# Altium project SmartMouse2016.PrjPcb
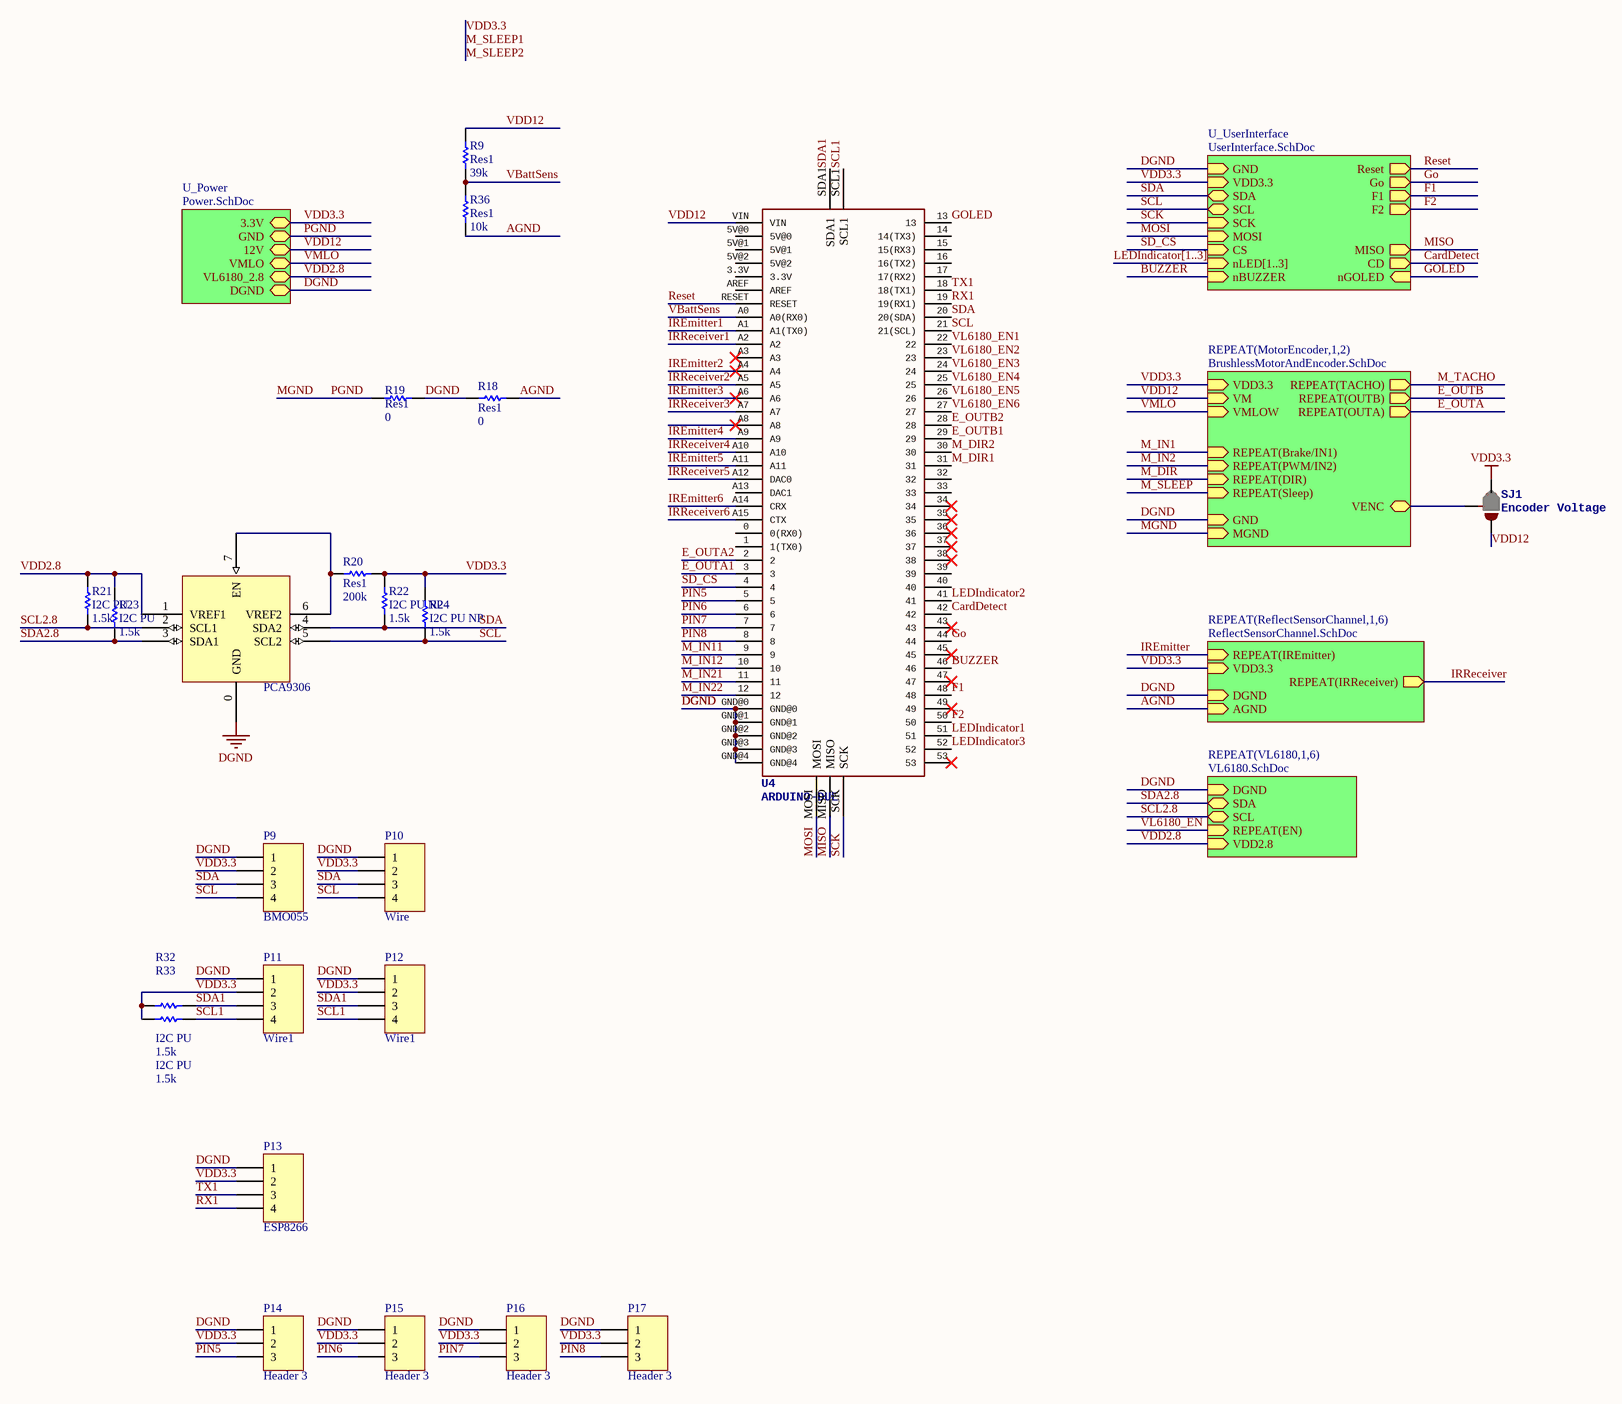
[diagram p0: Sheet1.SchDoc]
7 sheets, 151 parts. Net scope: strictly hierarchical (ports join the sheet entries above them; power ports are local).
Board file: SmartMouse2016.PcbDoc
Sheets:
  Sheet1.SchDoc
    ReflectSensorChannel1 = ReflectSensorChannel.SchDoc
    ReflectSensorChannel2 = ReflectSensorChannel.SchDoc
    ReflectSensorChannel3 = ReflectSensorChannel.SchDoc
    ReflectSensorChannel4 = ReflectSensorChannel.SchDoc
    ReflectSensorChannel5 = ReflectSensorChannel.SchDoc
    ReflectSensorChannel6 = ReflectSensorChannel.SchDoc
    U_UserInterface = UserInterface.SchDoc
      LEDIndicator1 = LEDChannel.SchDoc
      LEDIndicator2 = LEDChannel.SchDoc
      LEDIndicator3 = LEDChannel.SchDoc
    U_Power = Power.SchDoc
    MotorEncoder1 = BrushlessMotorAndEncoder.SchDoc
    MotorEncoder2 = BrushlessMotorAndEncoder.SchDoc
    VL61801 = VL6180.SchDoc
    VL61802 = VL6180.SchDoc
    VL61803 = VL6180.SchDoc
    VL61804 = VL6180.SchDoc
    VL61805 = VL6180.SchDoc
    VL61806 = VL6180.SchDoc

## Sheet Sheet1.SchDoc
size A2; PageSetup: Record=PageOptions|CenterHorizontal=True|CenterVertical=True|PrintScale=4.35|XCorrection=1.00|YCorrection=1.00|PrintKind=1|BorderSize=5000000|LeftOffset=0|BottomOffset=0|Orientation=2|PaperLength=1000|PaperWidth=1000|Scale=100|PaperSource=7|PrintQuality=-3|MediaType=1|DitherType=10|PrintScaleMode=1|PaperKind=A0|PaperIndex=139

### Parts
P9  BMO055  [PH_4_PTH]
P10  Wire  [PH_4_PTH]
P11  Wire1  [PH_4_PTH]
P12  Wire1  [PH_4_PTH]
P13  ESP8266  [PH_4_PTH]
P14  Header 3  [HDR1X3]
P15  Header 3  [HDR1X3]
P16  Header 3  [HDR1X3]
P17  Header 3  [HDR1X3]
PCA1  PCA9306  [SOIC_E200_8]
R9  Res1  value 39k  [RES_0805]
R18  Res1  value 0  [RES_0805]
R19  Res1  value 0  [RES_0805]
R20  Res1  value 200k  [RES_0805]
R21  I2C PU  value 1.5k  [RES_0805]
R22  I2C PU NP  value 1.5k  [RES_0805]
R23  I2C PU  value 1.5k  [RES_0805]
R24  I2C PU NP  value 1.5k  [RES_0805]
R32  I2C PU  value 1.5k  [RES_0805]
R33  I2C PU  value 1.5k  [RES_0805]
R36  Res1  value 10k  [RES_0805]
SJ1  Encoder Voltage  [PAD-JUMPER-3-2OF3_NC_BY_PASTE_YES_SILK_FULL_BOX]
U4  ARDUINO-DUE  [ARDUINO_DUE]

### Sub-sheets
REPEAT(MotorEncoder,1,2) = BrushlessMotorAndEncoder.SchDoc: VM, MGND, REPEAT(Brake/IN1) (in), REPEAT(PWM/IN2) (in), REPEAT(DIR) (in), REPEAT(TACHO) (out), GND, REPEAT(OUTB) (out), REPEAT(OUTA) (out), VDD3.3, REPEAT(Sleep) (in), VMLOW, VENC
REPEAT(ReflectSensorChannel,1,6) = ReflectSensorChannel.SchDoc: REPEAT(IREmitter) (in), REPEAT(IRReceiver) (out), VDD3.3, DGND, AGND
REPEAT(VL6180,1,6) = VL6180.SchDoc: DGND, SDA (bidir), SCL (bidir), REPEAT(EN) (in), VDD2.8
U_Power = Power.SchDoc: 3.3V, GND, 12V, VMLO, VL6180_2.8, DGND
U_UserInterface = UserInterface.SchDoc: GND, VDD3.3, SDA (bidir), SCL (bidir), Reset (out), Go (out), F1 (out), F2 (out), SCK (in), MISO (out), MOSI (in), CS (in), CD (out), nLED[1..3] (in), nBUZZER (in), nGOLED (in)

### Nets
AGND: R18.2 R36.1 ; sheet REPEAT(ReflectSensorChannel,1,6)/AGND
DGND: P9.1 P10.1 P11.1 P12.1 P13.1 P14.1 P15.1 P16.1 P17.1 PCA1.0(GND) R18.1 R19.2 U4.GND@0 U4.GND@1 U4.GND@2 U4.GND@3 U4.GND@4 ; sheet REPEAT(ReflectSensorChannel,1,6)/DGND, sheet U_UserInterface/GND, sheet U_Power/DGND, sheet REPEAT(MotorEncoder,1,2)/GND, sheet REPEAT(VL6180,1,6)/DGND
M_SLEEP1: P9.2 P10.2 P11.2 P12.2 P13.2 P14.2 P15.2 P16.2 P17.2 R20.2 R22.2 R24.2 R32.1 R33.1 SJ1.3 ; sheet REPEAT(ReflectSensorChannel,1,6)/VDD3.3, sheet U_UserInterface/VDD3.3, sheet U_Power/3.3V, sheet REPEAT(MotorEncoder,1,2)/VDD3.3  [also labelled M_SLEEP2, VDD3.3]  [project net LEDA]
MGND: R19.1 ; sheet U_Power/GND, sheet REPEAT(MotorEncoder,1,2)/MGND  [also labelled PGND]
VDD2.8: PCA1.1(VREF1) R21.2 R23.2 ; sheet U_Power/VL6180_2.8, sheet REPEAT(VL6180,1,6)/VDD2.8
VMLO: sheet U_Power/VMLO, sheet REPEAT(MotorEncoder,1,2)/VMLOW  [project net VDD_VMLO]
BUZZER: U4.46 ; sheet U_UserInterface/nBUZZER
CardDetect: U4.42 ; sheet U_UserInterface/CD
E_OUTA: sheet REPEAT(MotorEncoder,1,2)/REPEAT(OUTA)
E_OUTA1: U4.3
E_OUTA2: U4.2
E_OUTB: sheet REPEAT(MotorEncoder,1,2)/REPEAT(OUTB)
E_OUTB1: U4.29
E_OUTB2: U4.28
F1: U4.48 ; sheet U_UserInterface/F1
F2: U4.50 ; sheet U_UserInterface/F2
Go: U4.44 ; sheet U_UserInterface/Go
GOLED: U4.13 ; sheet U_UserInterface/nGOLED
IREmitter: sheet REPEAT(ReflectSensorChannel,1,6)/REPEAT(IREmitter)
IREmitter1: U4.A1(A1(TX0))
IREmitter2: U4.A4
IREmitter3: U4.A6
IREmitter4: U4.A9
IREmitter5: U4.A11
IREmitter6: U4.A14(CRX)
IRReceiver: sheet REPEAT(ReflectSensorChannel,1,6)/REPEAT(IRReceiver)
IRReceiver1: U4.A2
IRReceiver2: U4.A5
IRReceiver3: U4.A7
IRReceiver4: U4.A10
IRReceiver5: U4.A12(DAC0)
IRReceiver6: U4.A15(CTX)
LEDIndicator1: U4.51
LEDIndicator2: U4.41
LEDIndicator3: U4.52
M_DIR: sheet REPEAT(MotorEncoder,1,2)/REPEAT(DIR)
M_DIR1: U4.31
M_DIR2: U4.30
M_IN1: sheet REPEAT(MotorEncoder,1,2)/REPEAT(Brake/IN1)
M_IN2: sheet REPEAT(MotorEncoder,1,2)/REPEAT(PWM/IN2)
M_IN11: U4.9
M_IN12: U4.10
M_IN21: U4.11
M_IN22: U4.12
M_SLEEP: sheet REPEAT(MotorEncoder,1,2)/REPEAT(Sleep)
M_TACHO: sheet REPEAT(MotorEncoder,1,2)/REPEAT(TACHO)
MISO: U4.MISO ; sheet U_UserInterface/MISO
MOSI: U4.MOSI ; sheet U_UserInterface/MOSI
PIN5: P14.3 U4.5
PIN6: P15.3 U4.6
PIN7: P16.3 U4.7
PIN8: P17.3 U4.8
Reset: U4.RESET ; sheet U_UserInterface/Reset
RX1: P13.4 U4.19(19(RX1))
SCK: U4.SCK ; sheet U_UserInterface/SCK
SCL: P9.4 P10.4 PCA1.5(SCL2) R24.1 U4.21(21(SCL)) ; sheet U_UserInterface/SCL
SCL1: P11.4 P12.4 R33.2 U4.SCL1
SCL2.8: PCA1.2(SCL1) R21.1 ; sheet REPEAT(VL6180,1,6)/SCL
SD_CS: U4.4 ; sheet U_UserInterface/CS
SDA: P9.3 P10.3 PCA1.4(SDA2) R22.1 U4.20(20(SDA)) ; sheet U_UserInterface/SDA
SDA1: P11.3 P12.3 R32.2 U4.SDA1
SDA2.8: PCA1.3(SDA1) R23.1 ; sheet REPEAT(VL6180,1,6)/SDA
TX1: P13.3 U4.18(18(TX1))
VBattSens: R9.1 R36.2 U4.A0(A0(RX0))
VDD12: R9.2 SJ1.1 U4.VIN ; sheet U_Power/12V, sheet REPEAT(MotorEncoder,1,2)/VM  [project net SWITCHED_12]
VL6180_EN: sheet REPEAT(VL6180,1,6)/REPEAT(EN)
VL6180_EN1: U4.22
VL6180_EN2: U4.23
VL6180_EN3: U4.24
VL6180_EN4: U4.25
VL6180_EN5: U4.26
VL6180_EN6: U4.27
NetP2_MotorEncoder1_1: SJ1.2 ; sheet REPEAT(MotorEncoder,1,2)/VENC
NetPCA1_6: PCA1.6(VREF2) PCA1.7(EN) R20.1

Not connected (* = marked no-connect by the designer): U4 0(0(RX0)) 1(1(TX0)) 3.3V 5V@0 5V@1 5V@2 14(14(TX3)) 15(15(RX3)) 16(16(TX2)) 17(17(RX2)) 32 33 34* 35* 36* 37* 38* 39 40 43* 45* 47* 49* 53* A3* A8* A13(DAC1) AREF

### Buses and harness runs
bus LEDIndicator[1..3] = sheet U_UserInterface/nLED[1..3]

### Library data of the parts
P9-P13 = Header 4: Header, 4-Pin; LatestRevisionDate: 17-Jul-2002; LatestRevisionNote: Re-released for DXP Platform.; Publisher: Altium Limited
P14-P17 = Header 3: Header, 3-Pin; LatestRevisionDate: 17-Jul-2002; LatestRevisionNote: Re-released for DXP Platform.; Publisher: Altium Limited
PCA1 = Component_1_1: I2C shifting voltage; pin to pad: 0>1 1>2 2>3 3>4 4>5 5>6 6>7 7>8
R9 R18-R24 R32 R33 R36 = Res1: Resistor; Published: 8-Jun-2000; LatestRevisionDate: 17-Jul-2002; LatestRevisionNote: Re-released for DXP Platform.; PackageReference: AXIAL-0.3; Publisher: Altium Limited; PackageDescription: Axial Device, Thru-Hole; 2 Leads; 0.3 in Pin Spacing
SJ1 = JUMPER-PAD-3-2OF3_NC_BY_PASTE

## Sheet ReflectSensorChannel.SchDoc
size A
Used 6 times, as channels ReflectSensorChannel1, ReflectSensorChannel2, ReflectSensorChannel3, ReflectSensorChannel4, ReflectSensorChannel5, ReflectSensorChannel6. Parts and nets are listed once, with the designators drawn on the sheet.
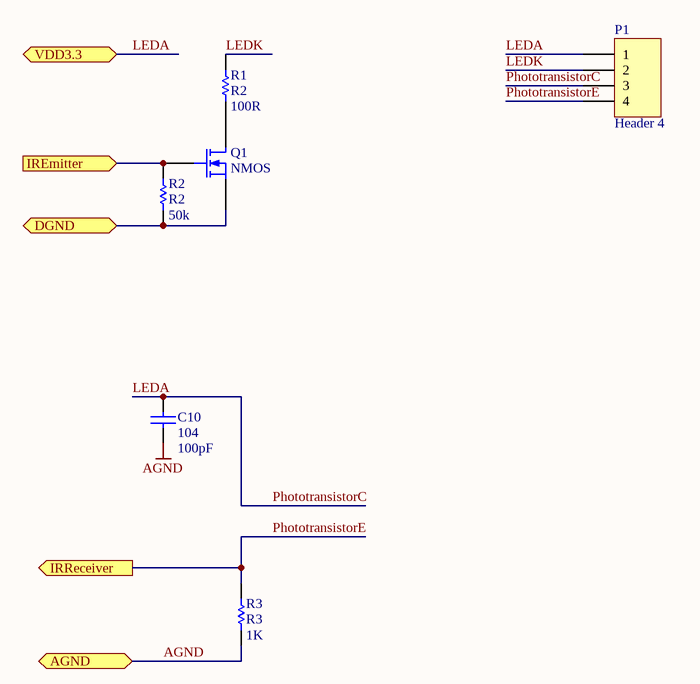
[diagram p1: ReflectSensorChannel.SchDoc]

### Parts
C10  104  value 100pF  [CAP_0805]
P1  Header 4  [PH_4_PTH]
Q1  NMOS  [SOT23-3]
R1  R2  value 100R  [RES_0805]
R2  R2  value 50k  [RES_0805]
R3  R3  value 1K  [RES_0805]

### Ports
AGND, DGND, IREmitter (in), IRReceiver (out), VDD3.3

### Nets
AGND: C10.1 R3.1 ; port AGND
DGND: Q1.3(S) R2.1 ; port DGND
IREmitter: Q1.2(G) R2.2 ; port IREmitter
LEDA: C10.2 P1.1 P1.3 ; port VDD3.3  [also labelled PhototransistorC]
LEDK: P1.2 R1.2
PhototransistorE: P1.4 R3.2 ; port IRReceiver
NetQ1_1: Q1.1(D) R1.1

### Channels
ReflectSensorChannel1: designators end in _ReflectSensorChannel1; ports AGND=AGND DGND=DGND IREmitter=IREmitter1 IRReceiver=IRReceiver1 VDD3.3=LEDA
ReflectSensorChannel2: designators end in _ReflectSensorChannel2; ports AGND=AGND DGND=DGND IREmitter=IREmitter2 IRReceiver=IRReceiver2 VDD3.3=LEDA
ReflectSensorChannel3: designators end in _ReflectSensorChannel3; ports AGND=AGND DGND=DGND IREmitter=IREmitter3 IRReceiver=IRReceiver3 VDD3.3=LEDA
ReflectSensorChannel4: designators end in _ReflectSensorChannel4; ports AGND=AGND DGND=DGND IREmitter=IREmitter4 IRReceiver=IRReceiver4 VDD3.3=LEDA
ReflectSensorChannel5: designators end in _ReflectSensorChannel5; ports AGND=AGND DGND=DGND IREmitter=IREmitter5 IRReceiver=IRReceiver5 VDD3.3=LEDA
ReflectSensorChannel6: designators end in _ReflectSensorChannel6; ports AGND=AGND DGND=DGND IREmitter=IREmitter6 IRReceiver=IRReceiver6 VDD3.3=LEDA

### Library data of the parts
C10 = Cap: Capacitor; Published: 8-Jun-2000; LatestRevisionDate: 17-Jul-2002; LatestRevisionNote: Re-released for DXP Platform.; PackageReference: RAD-0.3; Publisher: Altium Limited; PackageDescription: Radial Cap, Thru-Hole; 2 Leads; 0.3 in Pin Spacing
P1 = Header 4: Header, 4-Pin; LatestRevisionDate: 17-Jul-2002; LatestRevisionNote: Re-released for DXP Platform.; Publisher: Altium Limited
Q1 = MOSFET-N: N-Channel MOSFET; pin to pad: 1>3 2>1 3>2; Published: 8-Jun-2000; LatestRevisionDate: 17-Jul-2002; LatestRevisionNote: Re-released for DXP Platform.; PackageVersion: 1995/1996; PackageReference: E3; Publisher: Altium Limited; PackageDescription: TO, Flat Index; 3 In-Line, Axial Leads; Body Dia. 4.6mm; Lead Dia. 0.5 mm (max)
R1-R3 = Res1: Resistor; Published: 8-Jun-2000; LatestRevisionDate: 17-Jul-2002; LatestRevisionNote: Re-released for DXP Platform.; PackageReference: AXIAL-0.3; Publisher: Altium Limited; PackageDescription: Axial Device, Thru-Hole; 2 Leads; 0.3 in Pin Spacing

## Sheet UserInterface.SchDoc
size A
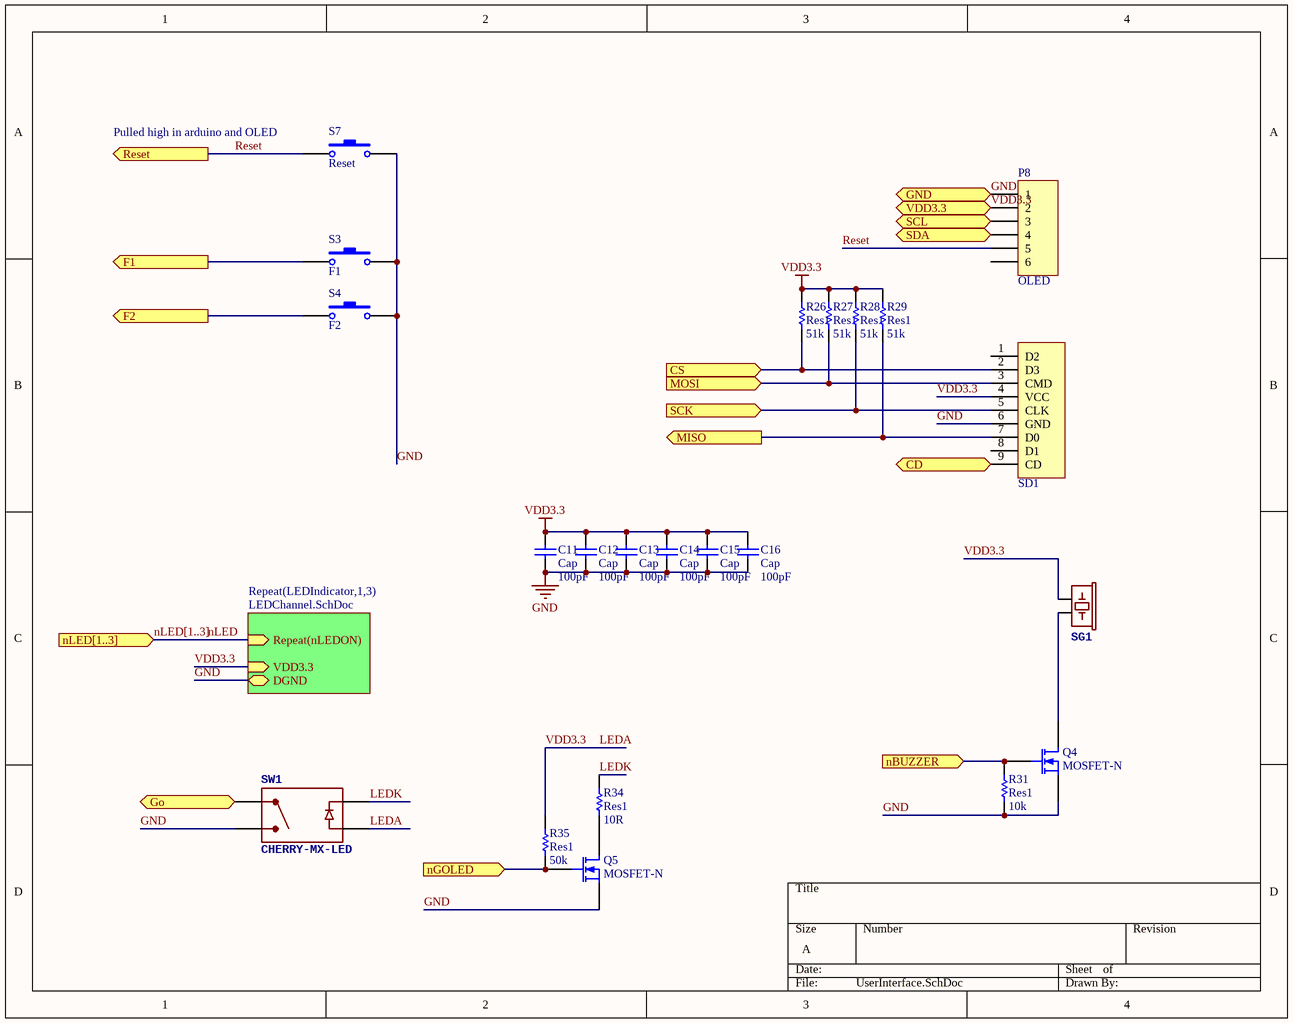
[diagram p2: UserInterface.SchDoc]

### Parts
C11  Cap  value 100pF  [CAP_0805]
C12  Cap  value 100pF  [CAP_0805]
C13  Cap  value 100pF  [CAP_0805]
C14  Cap  value 100pF  [CAP_0805]
C15  Cap  value 100pF  [CAP_0805]
C16  Cap  value 100pF  [CAP_0805]
P8  OLED  [OLEd]
Q4  MOSFET-N  [SOT23-3]
Q5  MOSFET-N  [SOT23-3]
R26  Res1  value 51k  [RES_0805]
R27  Res1  value 51k  [RES_0805]
R28  Res1  value 51k  [RES_0805]
R29  Res1  value 51k  [RES_0805]
R31  Res1  value 10k  [RES_0805]
R34  Res1  value 10R  [RES_0805]
R35  Res1  value 50k  [RES_0805]
S3  F1  [ButtonTACT_3x6x2.5_180]
S4  F2  [ButtonTACT_3x6x2.5_180]
S7  Reset  [ButtonTACT_3x6x2.5_180]
SD1  SD_Card_TF  [SD_Card_TF]  (value not drawn)
SG1  Buzzer 12mmSpark Fun Electronics SKU : Comp-Buzzer  [Buzzer_5x5]  (value not drawn)
SW1  CHERRY-MX-LED  [MX-LED]

### Sub-sheets
Repeat(LEDIndicator,1,3) = LEDChannel.SchDoc: DGND, VDD3.3 (in), Repeat(nLEDON) (in)

### Ports
CD (out), CS (in), F1 (out), F2 (out), GND, Go (out), MISO (out), MOSI (in), nBUZZER (in), nGOLED (in), nLED[1..3] (in), Reset (out), SCK (in), SCL (bidir), SDA (bidir), VDD3.3

### Nets
GND: C11.1 C12.1 C13.1 C14.1 C15.1 C16.1 P8.1 Q4.3(S) Q5.3(S) R31.1 S3.2 S4.2 S7.2 SD1.6(GND) SW1.P$2 ; port GND, sheet Repeat(LEDIndicator,1,3)/DGND  [project net DGND]
LEDA: C11.2 C12.2 C13.2 C14.2 C15.2 C16.2 P8.2 R26.2 R27.2 R28.2 R29.2 R35.2 SD1.4(VCC) SG1.+ SW1.P$4 ; port VDD3.3, sheet Repeat(LEDIndicator,1,3)/VDD3.3  [also labelled VDD3.3]
BUZZER: Q4.2(G) R31.2 ; port nBUZZER
CardDetect: SD1.9(CD) ; port CD
F1: S3.1 ; port F1
F2: S4.1 ; port F2
Go: SW1.P$1 ; port Go
GOLED: Q5.2(G) R35.1 ; port nGOLED
LEDK: R34.2 SW1.P$3
MISO: R29.1 SD1.7(D0) ; port MISO
MOSI: R27.1 SD1.3(CMD) ; port MOSI
nLED: sheet Repeat(LEDIndicator,1,3)/Repeat(nLEDON)
Reset: P8.5 S7.1 ; port Reset
SCK: R28.1 SD1.5(CLK) ; port SCK
SCL: P8.3 ; port SCL
SD_CS: R26.1 SD1.2(D3) ; port CS
SDA: P8.4 ; port SDA
NetQ4_1: Q4.1(D) SG1.-
NetQ5_1: Q5.1(D) R34.1

Not connected (* = marked no-connect by the designer): P8 6; SD1 1(D2) 8(D1)

### Buses and harness runs
bus nLED[1..3] = port nLED[1..3]

### Notes on the sheet
- (near S7) Pulled high in arduino and OLED

### Library data of the parts
C11-C16 = Cap: Capacitor; Published: 8-Jun-2000; LatestRevisionDate: 17-Jul-2002; LatestRevisionNote: Re-released for DXP Platform.; PackageReference: RAD-0.3; Publisher: Altium Limited; PackageDescription: Radial Cap, Thru-Hole; 2 Leads; 0.3 in Pin Spacing
P8 = Header 6: Header, 6-Pin; LatestRevisionDate: 17-Jul-2002; LatestRevisionNote: Re-released for DXP Platform.; Publisher: Altium Limited
Q4 Q5 = MOSFET-N: N-Channel MOSFET; pin to pad: 1>3 2>1 3>2; Published: 8-Jun-2000; LatestRevisionDate: 17-Jul-2002; LatestRevisionNote: Re-released for DXP Platform.; PackageVersion: 1995/1996; PackageReference: E3; Publisher: Altium Limited; PackageDescription: TO, Flat Index; 3 In-Line, Axial Leads; Body Dia. 4.6mm; Lead Dia. 0.5 mm (max)
R26-R29 R31 R34 R35 = Res1: Resistor; Published: 8-Jun-2000; LatestRevisionDate: 17-Jul-2002; LatestRevisionNote: Re-released for DXP Platform.; PackageReference: AXIAL-0.3; Publisher: Altium Limited; PackageDescription: Axial Device, Thru-Hole; 2 Leads; 0.3 in Pin Spacing
S3 S4 S7 = SW-PB: Switch; Published: 24-Mar-1999; LatestRevisionDate: 17-Jul-2002; LatestRevisionNote: Re-released for DXP Platform.; PackageReference: SPST-2; Publisher: Altium Limited; PackageDescription: Switch; 2 Leads
SD1 = SD_Card_TF: SD
SG1 = BUZZERPTH: pin to pad: +>P ->N

## Sheet LEDChannel.SchDoc
size A
Used 3 times, as channels U_UserInterface/LEDIndicator1, U_UserInterface/LEDIndicator2, U_UserInterface/LEDIndicator3. Parts and nets are listed once, with the designators drawn on the sheet.
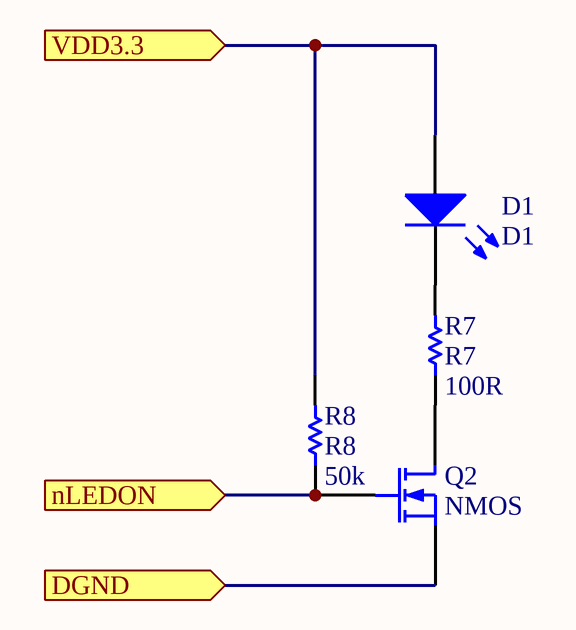
[diagram p3: LEDChannel.SchDoc]

### Parts
D1  D1  [LED_0805_GREEN]
Q2  NMOS  [SOT23-3]
R7  R7  value 100R  [RES_0805]
R8  R8  value 50k  [RES_0805]

### Ports
DGND (in), nLEDON (in), VDD3.3 (in)

### Nets
DGND: Q2.3(S) ; port DGND
nLEDON: Q2.2(G) R8.1 ; port nLEDON
VDD3.3: D1.1(A) R8.2 ; port VDD3.3
NetD1_2: D1.2(K) R7.2
NetQ2_1: Q2.1(D) R7.1

### Channels
U_UserInterface/LEDIndicator1: designators end in _LEDIndicator1; ports DGND=DGND nLEDON=LEDIndicator1 VDD3.3=LEDA
U_UserInterface/LEDIndicator2: designators end in _LEDIndicator2; ports DGND=DGND nLEDON=LEDIndicator2 VDD3.3=LEDA
U_UserInterface/LEDIndicator3: designators end in _LEDIndicator3; ports DGND=DGND nLEDON=LEDIndicator3 VDD3.3=LEDA

### Library data of the parts
D1 = LED0: Typical INFRARED GaAs LED; Published: 8-Jun-2000; LatestRevisionDate: 08-Jul-2005; LatestRevisionNote: Mech Layer 1 removed.; PackageReference: LED-0; Publisher: Altium Limited; PackageDescription: LED; 2 Leads
Q2 = MOSFET-N: N-Channel MOSFET; pin to pad: 1>3 2>1 3>2; Published: 8-Jun-2000; LatestRevisionDate: 17-Jul-2002; LatestRevisionNote: Re-released for DXP Platform.; PackageVersion: 1995/1996; PackageReference: E3; Publisher: Altium Limited; PackageDescription: TO, Flat Index; 3 In-Line, Axial Leads; Body Dia. 4.6mm; Lead Dia. 0.5 mm (max)
R7 R8 = Res1: Resistor; Published: 8-Jun-2000; LatestRevisionDate: 17-Jul-2002; LatestRevisionNote: Re-released for DXP Platform.; PackageReference: AXIAL-0.3; Publisher: Altium Limited; PackageDescription: Axial Device, Thru-Hole; 2 Leads; 0.3 in Pin Spacing

## Sheet Power.SchDoc
size A
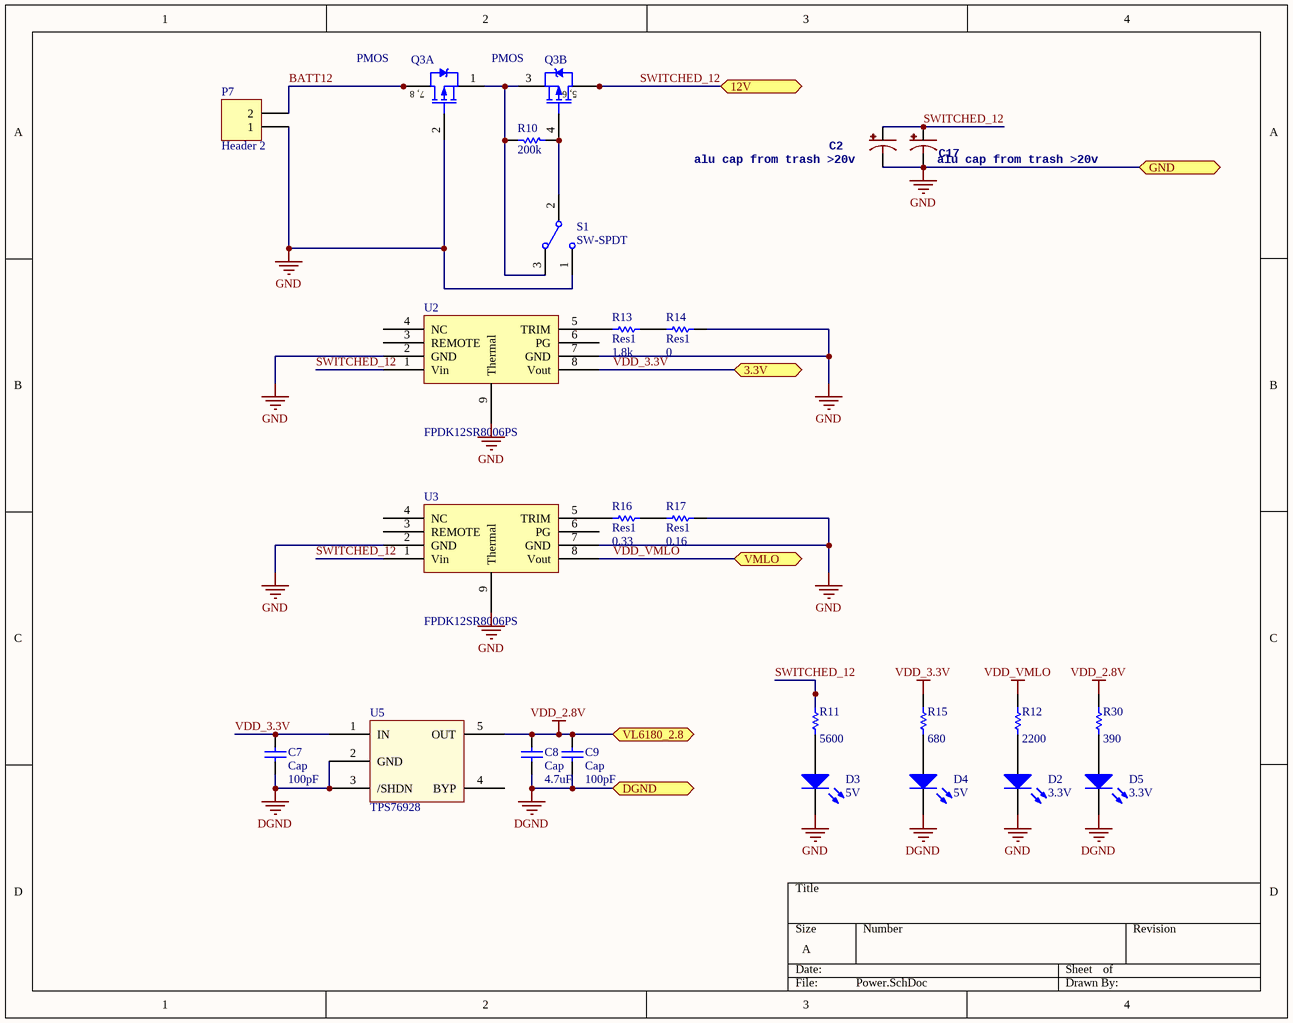
[diagram p4: Power.SchDoc]

### Parts
C2  alu cap from trash >20v  [PANASONIC_D]
C7  Cap  value 100pF  [CAP_0805]
C8  Cap  value 4.7uF  [CAP_0805]
C9  Cap  value 100pF  [CAP_0805]
C17  alu cap from trash >20v  [PANASONIC_D]
D2  3.3V  [LED_0805_GREEN]
D3  5V  [LED_0805_GREEN]
D4  5V  [LED_0805_GREEN]
D5  3.3V  [LED_0805_GREEN]
P7  Header 2  [HX2.54-2]
Q3  PMOS  [SOIC_E200_8]  (parts A,B of 2)
R10  value 200k  [RES_0805]  (hidden comment: Res)
R11  value 5600  [RES_0805]  (hidden comment: Res)
R12  value 2200  [RES_0805]  (hidden comment: Res)
R13  Res1  value 1.8k  [RES_0805]
R14  Res1  value 0  [RES_0805]
R15  value 680  [RES_0805]  (hidden comment: Res)
R16  Res1  value 0.33  [RES_0805]
R17  Res1  value 0.16  [RES_0805]
R30  value 390  [RES_0805]  (hidden comment: Res)
S1  SW-SPDT  [G3T-12AH]
U2  FPDK12SR8006PS  [FPDK12SR8006]
U3  FPDK12SR8006PS  [FPDK12SR8006]
U5  TPS76928  [SOT23-5]

### Ports
3.3V, 12V, DGND, GND, VL6180_2.8, VMLO

### Nets
DGND: C7.1 C8.1 C9.1 D4.2(K) D5.2(K) U5.2(GND) U5.3(/SHDN) ; port DGND
GND: C2.- C17.- D2.2(K) D3.2(K) P7.1 Q3.2(G) R14.2 R17.2 S1.1 U2.2(GND) U2.7(GND) U2.9(Thermal) U3.2(GND) U3.7(GND) U3.9(Thermal) ; port GND  [project net MGND]
VDD_2.8V: C8.2 C9.2 R30.2 U5.5(OUT) ; port VL6180_2.8  [project net VDD2.8]
VDD_3.3V: C7.2 R15.2 U2.8(Vout) U5.1(IN) ; port 3.3V  [project net LEDA]
VDD_VMLO: R12.2 U3.8(Vout) ; port VMLO
BATT12: P7.2 Q3.7(D) Q3.8(D)
SWITCHED_12: C2.+ C17.+ Q3.5(D) Q3.6(D) R11.2 U2.1(Vin) U3.1(Vin) ; port 12V
NetD2_1: D2.1(A) R12.1
NetD3_1: D3.1(A) R11.1
NetD4_1: D4.1(A) R15.1
NetD5_1: D5.1(A) R30.1
NetQ3_1: Q3.1(S) Q3.3(S) R10.1 S1.3
NetQ3_4: Q3.4(G) R10.2 S1.2
NetR13_1: R13.1 U2.5(TRIM)
NetR13_2: R13.2 R14.1
NetR16_1: R16.1 U3.5(TRIM)
NetR16_2: R16.2 R17.1

Not connected (* = marked no-connect by the designer): U2 3(REMOTE) 4(NC) 6(PG); U3 3(REMOTE) 4(NC) 6(PG); U5 4(BYP)

### Notes on the sheet
- (in symbol IRF7316, part A) 7, 8
- (in symbol IRF7316, part B) 5, 6

### Library data of the parts
C2 C17 = CAP_POLD
C7-C9 = Cap: Capacitor; Published: 8-Jun-2000; LatestRevisionDate: 17-Jul-2002; LatestRevisionNote: Re-released for DXP Platform.; PackageReference: RAD-0.3; Publisher: Altium Limited; PackageDescription: Radial Cap, Thru-Hole; 2 Leads; 0.3 in Pin Spacing
D2-D5 = LED0: LED 1206 green; Published: 8-Jun-2000; LatestRevisionDate: 08-Jul-2005; LatestRevisionNote: Mech Layer 1 removed.; PackageReference: LED-0; Publisher: Altium Limited
P7 = Header 2: Header, 2-Pin; LatestRevisionDate: 17-Jul-2002; LatestRevisionNote: Re-released for DXP Platform.; Publisher: Altium Limited
Q3 = IRF7316: Dual PMOS; Published: 8-Jun-2000; LatestRevisionDate: 13-Apr-2006; LatestRevisionNote: IPC-7351 Footprint Added.; DatasheetVersion: Aug-1997; PackageVersion: Feb-2001; PackageReference: SO-8; Publisher: Altium Limited; PackageDescription: 8-Pin Plastic Small Outline Integrated Circuit 1.27 mm Pitch; Code_JEDEC: MS-012-AA; Code_IPC: SOIC127P600-8; ComponentLink1Description: Manufacturer Link; ComponentLink1URL: http://www.irf.com/; ComponentLink2Description: Datasheet; ComponentLink2URL: http://www.irf.com/product-info/datasheets/data/irf7316.pdf
R10-R17 R30 = Res1: Resistor; Published: 8-Jun-2000; LatestRevisionDate: 17-Jul-2002; LatestRevisionNote: Re-released for DXP Platform.; PackageReference: AXIAL-0.3; Publisher: Altium Limited
  R13 R14 R16 R17: PackageDescription: Axial Device, Thru-Hole; 2 Leads; 0.3 in Pin Spacing
S1 = SW-SPDT: SPDT Subminiature Toggle Switch, Right Angle Mounting, Vertical Actuation; Published: 24-Mar-1999; LatestRevisionDate: 17-Dec-2003; LatestRevisionNote: Schematic revised, PCB Footprint replaced.; DatasheetVersion: 05-Dec-2000; PackageReference: TL36WW15050; Publisher: Altium Limited; PackageDescription: Switch; 4 Leads; ComponentLink1Description: Manufacturer Link; ComponentLink1URL: http://www.apem.com

## Sheet BrushlessMotorAndEncoder.SchDoc
size A
Used 2 times, as channels MotorEncoder1, MotorEncoder2. Parts and nets are listed once, with the designators drawn on the sheet.
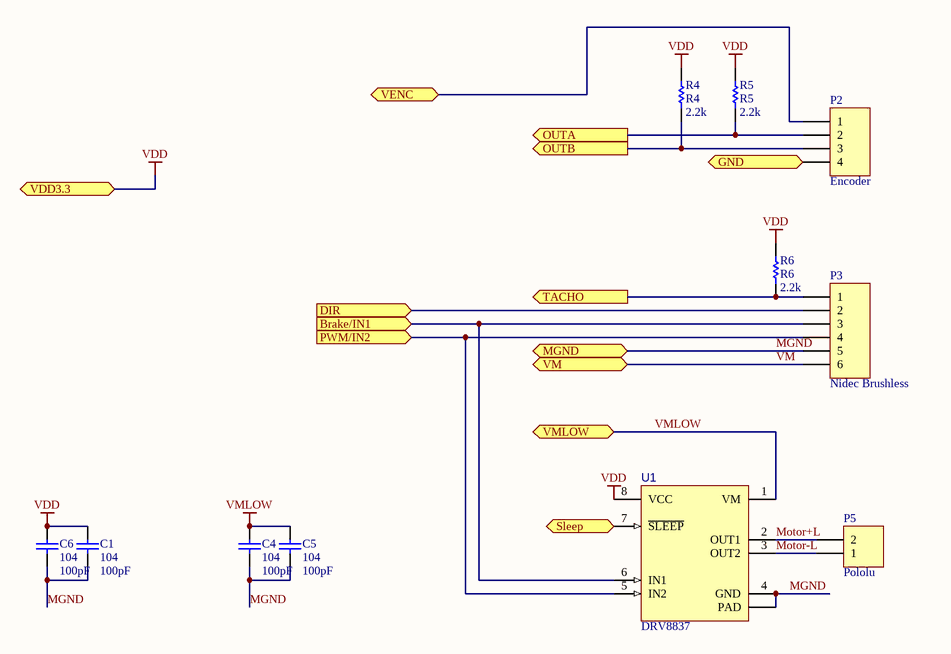
[diagram p5: BrushlessMotorAndEncoder.SchDoc]

### Parts
C1  104  value 100pF  [CAP_0805]
C4  104  value 100pF  [CAP_0805]
C5  104  value 100pF  [CAP_0805]
C6  104  value 100pF  [CAP_0805]
P2  Encoder  [PH_4_PTH]
P3  Nidec Brushless  [PH_6_PTH]
P5  Pololu  [PH_2_PTH]
R4  R4  value 2.2k  [RES_0805]
R5  R5  value 2.2k  [RES_0805]
R6  R6  value 2.2k  [RES_0805]
U1  DRV8837  [DSG0008A]

### Ports
Brake/IN1 (in), DIR (in), GND, MGND, OUTA (out), OUTB (out), PWM/IN2 (in), Sleep (in), TACHO (out), VDD3.3, VENC, VM, VMLOW

### Nets
VDD: C1.2 C6.2 R4.2 R5.2 R6.2 U1.8(VCC) ; port VDD3.3
VMLOW: C4.2 C5.2 U1.1(VM) ; port VMLOW
Brake/IN1: P3.3 U1.6(IN1) ; port Brake/IN1
DIR: P3.2 ; port DIR
GND: P2.4 ; port GND
MGND: C1.1 C4.1 C5.1 C6.1 P3.5 U1.4(GND) U1.9(PAD) ; port MGND
Motor+L: P5.2 U1.2(OUT1)
Motor-L: P5.1 U1.3(OUT2)
OUTA: P2.2 R5.1 ; port OUTA
OUTB: P2.3 R4.1 ; port OUTB
PWM/IN2: P3.4 U1.5(IN2) ; port PWM/IN2
Sleep: U1.7(~{SLEEP}) ; port Sleep
TACHO: P3.1 R6.1 ; port TACHO
VENC: P2.1 ; port VENC
VM: P3.6 ; port VM

### Channels
MotorEncoder1: designators end in _MotorEncoder1; ports Brake/IN1=M_IN11 DIR=M_DIR1 GND=DGND MGND=MGND OUTA=E_OUTA1 OUTB=E_OUTB1 PWM/IN2=M_IN21 Sleep=LEDA TACHO=M_TACHO1 VDD3.3=LEDA VENC=NetP2_MotorEncoder1_1 VM=SWITCHED_12 VMLOW=VDD_VMLO
MotorEncoder2: designators end in _MotorEncoder2; ports Brake/IN1=M_IN12 DIR=M_DIR2 GND=DGND MGND=MGND OUTA=E_OUTA2 OUTB=E_OUTB2 PWM/IN2=M_IN22 Sleep=LEDA TACHO=M_TACHO2 VDD3.3=LEDA VENC=NetP2_MotorEncoder1_1 VM=SWITCHED_12 VMLOW=VDD_VMLO

### Library data of the parts
C1 C4-C6 = Cap: Capacitor; Published: 8-Jun-2000; LatestRevisionDate: 17-Jul-2002; LatestRevisionNote: Re-released for DXP Platform.; PackageReference: RAD-0.3; Publisher: Altium Limited; PackageDescription: Radial Cap, Thru-Hole; 2 Leads; 0.3 in Pin Spacing
P2 = Header 4: Header, 4-Pin; LatestRevisionDate: 17-Jul-2002; LatestRevisionNote: Re-released for DXP Platform.; Publisher: Altium Limited
P3 = Header 6: Header, 6-Pin; LatestRevisionDate: 17-Jul-2002; LatestRevisionNote: Re-released for DXP Platform.; Publisher: Altium Limited
P5 = Header 2: Header, 2-Pin; LatestRevisionDate: 17-Jul-2002; LatestRevisionNote: Re-released for DXP Platform.; Publisher: Altium Limited
R4-R6 = Res1: Resistor; Published: 8-Jun-2000; LatestRevisionDate: 17-Jul-2002; LatestRevisionNote: Re-released for DXP Platform.; PackageReference: AXIAL-0.3; Publisher: Altium Limited; PackageDescription: Axial Device, Thru-Hole; 2 Leads; 0.3 in Pin Spacing
U1 = DRV8837DSG: LOW-VOLTAGE H-BRIDGE IC, DSG0008A; Alternate Manufacturer: None; Manufacturer: Texas Instruments; SymbolCreator: a0411947; U/M: EA; SymbolVersion: 2013-08-22; PartNumber: DRV8837DSG; PackageReference: DSG0008A; MountType: SMT; ComponentLink1Description: Datasheet Link; ComponentLink1URL: http://www.ti.com/lit/ds/symlink/drv8837.pdf; CompType: IC; RoHS: Y; Publisher: Texas Instruments; LatestRevisionDate: 2013-09-10; LatestRevisionNote: Added Parts

## Sheet VL6180.SchDoc
size A
Used 6 times, as channels VL61801, VL61802, VL61803, VL61804, VL61805, VL61806. Parts and nets are listed once, with the designators drawn on the sheet.
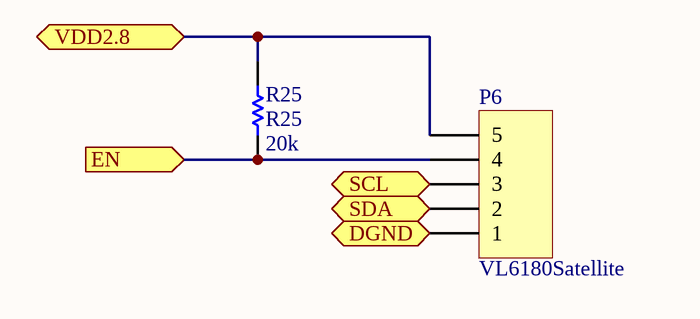
[diagram p6: VL6180.SchDoc]

### Parts
P6  VL6180Satellite  [PH_5_PTH]
R25  R25  value 20k  [RES_0805]

### Ports
DGND, EN (in), SCL (bidir), SDA (bidir), VDD2.8

### Nets
DGND: P6.1 ; port DGND
EN: P6.4 R25.1 ; port EN
SCL: P6.3 ; port SCL
SDA: P6.2 ; port SDA
VDD2.8: P6.5 R25.2 ; port VDD2.8

### Channels
VL61801: designators end in _VL61801; ports DGND=DGND EN=VL6180_EN1 SCL=SCL2.8 SDA=SDA2.8 VDD2.8=VDD2.8
VL61802: designators end in _VL61802; ports DGND=DGND EN=VL6180_EN2 SCL=SCL2.8 SDA=SDA2.8 VDD2.8=VDD2.8
VL61803: designators end in _VL61803; ports DGND=DGND EN=VL6180_EN3 SCL=SCL2.8 SDA=SDA2.8 VDD2.8=VDD2.8
VL61804: designators end in _VL61804; ports DGND=DGND EN=VL6180_EN4 SCL=SCL2.8 SDA=SDA2.8 VDD2.8=VDD2.8
VL61805: designators end in _VL61805; ports DGND=DGND EN=VL6180_EN5 SCL=SCL2.8 SDA=SDA2.8 VDD2.8=VDD2.8
VL61806: designators end in _VL61806; ports DGND=DGND EN=VL6180_EN6 SCL=SCL2.8 SDA=SDA2.8 VDD2.8=VDD2.8

### Library data of the parts
P6 = Header 5: Header, 5-Pin; LatestRevisionDate: 17-Jul-2002; LatestRevisionNote: Re-released for DXP Platform.; Publisher: Altium Limited
R25 = Res1: Resistor; Published: 8-Jun-2000; LatestRevisionDate: 17-Jul-2002; LatestRevisionNote: Re-released for DXP Platform.; PackageReference: AXIAL-0.3; Publisher: Altium Limited; PackageDescription: Axial Device, Thru-Hole; 2 Leads; 0.3 in Pin Spacing

## Nets that join several sheets
AGND: Sheet1 (R18.2 R36.1), ReflectSensorChannel1 (C10_ReflectSensorChannel1.1 R3_ReflectSensorChannel1.1), ReflectSensorChannel2 (C10_ReflectSensorChannel2.1 R3_ReflectSensorChannel2.1), ReflectSensorChannel3 (C10_ReflectSensorChannel3.1 R3_ReflectSensorChannel3.1), ReflectSensorChannel4 (C10_ReflectSensorChannel4.1 R3_ReflectSensorChannel4.1), ReflectSensorChannel5 (C10_ReflectSensorChannel5.1 R3_ReflectSensorChannel5.1), ReflectSensorChannel6 (C10_ReflectSensorChannel6.1 R3_ReflectSensorChannel6.1)
DGND: Sheet1 (17 pins), ReflectSensorChannel1 (Q1_ReflectSensorChannel1.3 R2_ReflectSensorChannel1.1), ReflectSensorChannel2 (Q1_ReflectSensorChannel2.3 R2_ReflectSensorChannel2.1), ReflectSensorChannel3 (Q1_ReflectSensorChannel3.3 R2_ReflectSensorChannel3.1), ReflectSensorChannel4 (Q1_ReflectSensorChannel4.3 R2_ReflectSensorChannel4.1), ReflectSensorChannel5 (Q1_ReflectSensorChannel5.3 R2_ReflectSensorChannel5.1), ReflectSensorChannel6 (Q1_ReflectSensorChannel6.3 R2_ReflectSensorChannel6.1), UserInterface (15 pins), U_UserInterface/LEDIndicator1 (Q2_LEDIndicator1.3), U_UserInterface/LEDIndicator2 (Q2_LEDIndicator2.3), U_UserInterface/LEDIndicator3 (Q2_LEDIndicator3.3), Power (7 pins), MotorEncoder1 (P2_MotorEncoder1.4), MotorEncoder2 (P2_MotorEncoder2.4), VL61801 (P6_VL61801.1), VL61802 (P6_VL61802.1), VL61803 (P6_VL61803.1), VL61804 (P6_VL61804.1), VL61805 (P6_VL61805.1), VL61806 (P6_VL61806.1)
LEDA: Sheet1 (15 pins), ReflectSensorChannel1 (C10_ReflectSensorChannel1.2 P1_ReflectSensorChannel1.1 P1_ReflectSensorChannel1.3), ReflectSensorChannel2 (C10_ReflectSensorChannel2.2 P1_ReflectSensorChannel2.1 P1_ReflectSensorChannel2.3), ReflectSensorChannel3 (C10_ReflectSensorChannel3.2 P1_ReflectSensorChannel3.1 P1_ReflectSensorChannel3.3), ReflectSensorChannel4 (C10_ReflectSensorChannel4.2 P1_ReflectSensorChannel4.1 P1_ReflectSensorChannel4.3), ReflectSensorChannel5 (C10_ReflectSensorChannel5.2 P1_ReflectSensorChannel5.1 P1_ReflectSensorChannel5.3), ReflectSensorChannel6 (C10_ReflectSensorChannel6.2 P1_ReflectSensorChannel6.1 P1_ReflectSensorChannel6.3), UserInterface (15 pins), U_UserInterface/LEDIndicator1 (D1_LEDIndicator1.1 R8_LEDIndicator1.2), U_UserInterface/LEDIndicator2 (D1_LEDIndicator2.1 R8_LEDIndicator2.2), U_UserInterface/LEDIndicator3 (D1_LEDIndicator3.1 R8_LEDIndicator3.2), Power (C7.2 R15.2 U2.8 U5.1), MotorEncoder1 (7 pins), MotorEncoder2 (7 pins)
MGND: Sheet1 (R19.1), Power (15 pins), MotorEncoder1 (7 pins), MotorEncoder2 (7 pins)
VDD2.8: Sheet1 (PCA1.1 R21.2 R23.2), Power (C8.2 C9.2 R30.2 U5.5), VL61801 (P6_VL61801.5 R25_VL61801.2), VL61802 (P6_VL61802.5 R25_VL61802.2), VL61803 (P6_VL61803.5 R25_VL61803.2), VL61804 (P6_VL61804.5 R25_VL61804.2), VL61805 (P6_VL61805.5 R25_VL61805.2), VL61806 (P6_VL61806.5 R25_VL61806.2)
VDD_VMLO: Power (R12.2 U3.8), MotorEncoder1 (C4_MotorEncoder1.2 C5_MotorEncoder1.2 U1_MotorEncoder1.1), MotorEncoder2 (C4_MotorEncoder2.2 C5_MotorEncoder2.2 U1_MotorEncoder2.1)
BUZZER: Sheet1 (U4.46), UserInterface (Q4.2 R31.2)
CardDetect: Sheet1 (U4.42), UserInterface (SD1.9)
E_OUTA1: Sheet1 (U4.3), MotorEncoder1 (P2_MotorEncoder1.2 R5_MotorEncoder1.1)
E_OUTA2: Sheet1 (U4.2), MotorEncoder2 (P2_MotorEncoder2.2 R5_MotorEncoder2.1)
E_OUTB1: Sheet1 (U4.29), MotorEncoder1 (P2_MotorEncoder1.3 R4_MotorEncoder1.1)
E_OUTB2: Sheet1 (U4.28), MotorEncoder2 (P2_MotorEncoder2.3 R4_MotorEncoder2.1)
F1: Sheet1 (U4.48), UserInterface (S3.1)
F2: Sheet1 (U4.50), UserInterface (S4.1)
Go: Sheet1 (U4.44), UserInterface (SW1.P$1)
GOLED: Sheet1 (U4.13), UserInterface (Q5.2 R35.1)
IREmitter1: Sheet1 (U4.A1), ReflectSensorChannel1 (Q1_ReflectSensorChannel1.2 R2_ReflectSensorChannel1.2)
IREmitter2: Sheet1 (U4.A4), ReflectSensorChannel2 (Q1_ReflectSensorChannel2.2 R2_ReflectSensorChannel2.2)
IREmitter3: Sheet1 (U4.A6), ReflectSensorChannel3 (Q1_ReflectSensorChannel3.2 R2_ReflectSensorChannel3.2)
IREmitter4: Sheet1 (U4.A9), ReflectSensorChannel4 (Q1_ReflectSensorChannel4.2 R2_ReflectSensorChannel4.2)
IREmitter5: Sheet1 (U4.A11), ReflectSensorChannel5 (Q1_ReflectSensorChannel5.2 R2_ReflectSensorChannel5.2)
IREmitter6: Sheet1 (U4.A14), ReflectSensorChannel6 (Q1_ReflectSensorChannel6.2 R2_ReflectSensorChannel6.2)
IRReceiver1: Sheet1 (U4.A2), ReflectSensorChannel1 (P1_ReflectSensorChannel1.4 R3_ReflectSensorChannel1.2)
IRReceiver2: Sheet1 (U4.A5), ReflectSensorChannel2 (P1_ReflectSensorChannel2.4 R3_ReflectSensorChannel2.2)
IRReceiver3: Sheet1 (U4.A7), ReflectSensorChannel3 (P1_ReflectSensorChannel3.4 R3_ReflectSensorChannel3.2)
IRReceiver4: Sheet1 (U4.A10), ReflectSensorChannel4 (P1_ReflectSensorChannel4.4 R3_ReflectSensorChannel4.2)
IRReceiver5: Sheet1 (U4.A12), ReflectSensorChannel5 (P1_ReflectSensorChannel5.4 R3_ReflectSensorChannel5.2)
IRReceiver6: Sheet1 (U4.A15), ReflectSensorChannel6 (P1_ReflectSensorChannel6.4 R3_ReflectSensorChannel6.2)
LEDIndicator1: Sheet1 (U4.51), U_UserInterface/LEDIndicator1 (Q2_LEDIndicator1.2 R8_LEDIndicator1.1)
LEDIndicator2: Sheet1 (U4.41), U_UserInterface/LEDIndicator2 (Q2_LEDIndicator2.2 R8_LEDIndicator2.1)
LEDIndicator3: Sheet1 (U4.52), U_UserInterface/LEDIndicator3 (Q2_LEDIndicator3.2 R8_LEDIndicator3.1)
M_DIR1: Sheet1 (U4.31), MotorEncoder1 (P3_MotorEncoder1.2)
M_DIR2: Sheet1 (U4.30), MotorEncoder2 (P3_MotorEncoder2.2)
M_IN11: Sheet1 (U4.9), MotorEncoder1 (P3_MotorEncoder1.3 U1_MotorEncoder1.6)
M_IN12: Sheet1 (U4.10), MotorEncoder2 (P3_MotorEncoder2.3 U1_MotorEncoder2.6)
M_IN21: Sheet1 (U4.11), MotorEncoder1 (P3_MotorEncoder1.4 U1_MotorEncoder1.5)
M_IN22: Sheet1 (U4.12), MotorEncoder2 (P3_MotorEncoder2.4 U1_MotorEncoder2.5)
MISO: Sheet1 (U4.MISO), UserInterface (R29.1 SD1.7)
MOSI: Sheet1 (U4.MOSI), UserInterface (R27.1 SD1.3)
NetP2_MotorEncoder1_1: Sheet1 (SJ1.2), MotorEncoder1 (P2_MotorEncoder1.1), MotorEncoder2 (P2_MotorEncoder2.1)
Reset: Sheet1 (U4.RESET), UserInterface (P8.5 S7.1)
SCK: Sheet1 (U4.SCK), UserInterface (R28.1 SD1.5)
SCL: Sheet1 (5 pins), UserInterface (P8.3)
SCL2.8: Sheet1 (PCA1.2 R21.1), VL61801 (P6_VL61801.3), VL61802 (P6_VL61802.3), VL61803 (P6_VL61803.3), VL61804 (P6_VL61804.3), VL61805 (P6_VL61805.3), VL61806 (P6_VL61806.3)
SD_CS: Sheet1 (U4.4), UserInterface (R26.1 SD1.2)
SDA: Sheet1 (5 pins), UserInterface (P8.4)
SDA2.8: Sheet1 (PCA1.3 R23.1), VL61801 (P6_VL61801.2), VL61802 (P6_VL61802.2), VL61803 (P6_VL61803.2), VL61804 (P6_VL61804.2), VL61805 (P6_VL61805.2), VL61806 (P6_VL61806.2)
SWITCHED_12: Sheet1 (R9.2 SJ1.1 U4.VIN), Power (7 pins), MotorEncoder1 (P3_MotorEncoder1.6), MotorEncoder2 (P3_MotorEncoder2.6)
VL6180_EN1: Sheet1 (U4.22), VL61801 (P6_VL61801.4 R25_VL61801.1)
VL6180_EN2: Sheet1 (U4.23), VL61802 (P6_VL61802.4 R25_VL61802.1)
VL6180_EN3: Sheet1 (U4.24), VL61803 (P6_VL61803.4 R25_VL61803.1)
VL6180_EN4: Sheet1 (U4.25), VL61804 (P6_VL61804.4 R25_VL61804.1)
VL6180_EN5: Sheet1 (U4.26), VL61805 (P6_VL61805.4 R25_VL61805.1)
VL6180_EN6: Sheet1 (U4.27), VL61806 (P6_VL61806.4 R25_VL61806.1)